# EAGLE design ultravolt_daughterboard (EAGLE 9.0.1)
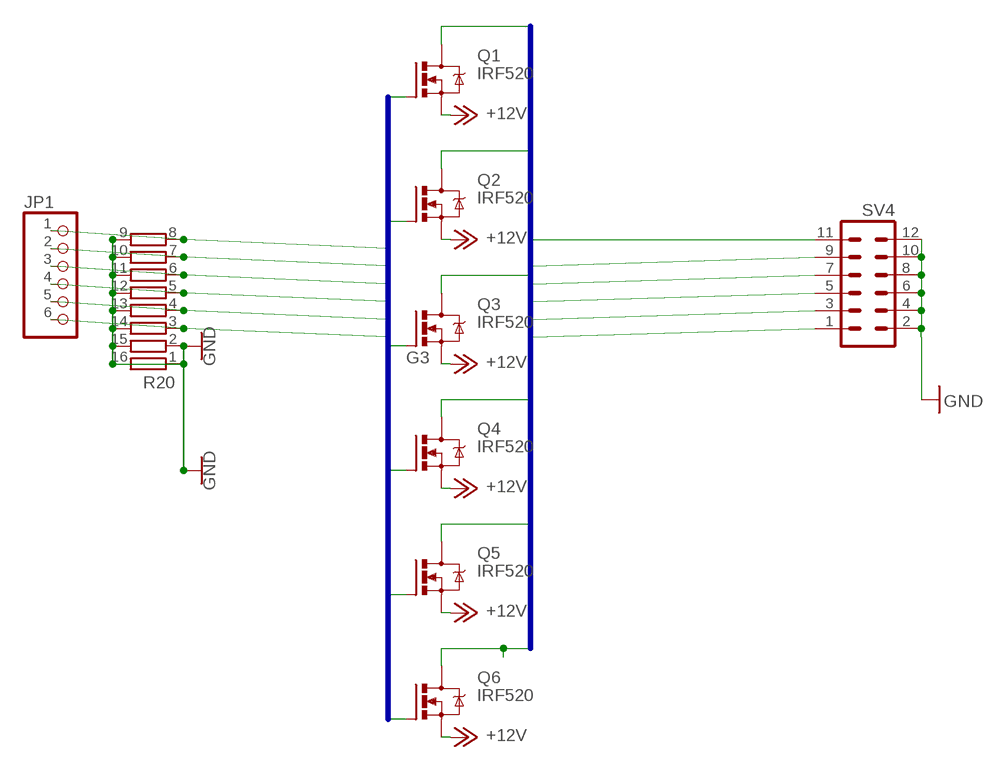
[diagram p0: schematic, sheet 1, part 1 of 2]
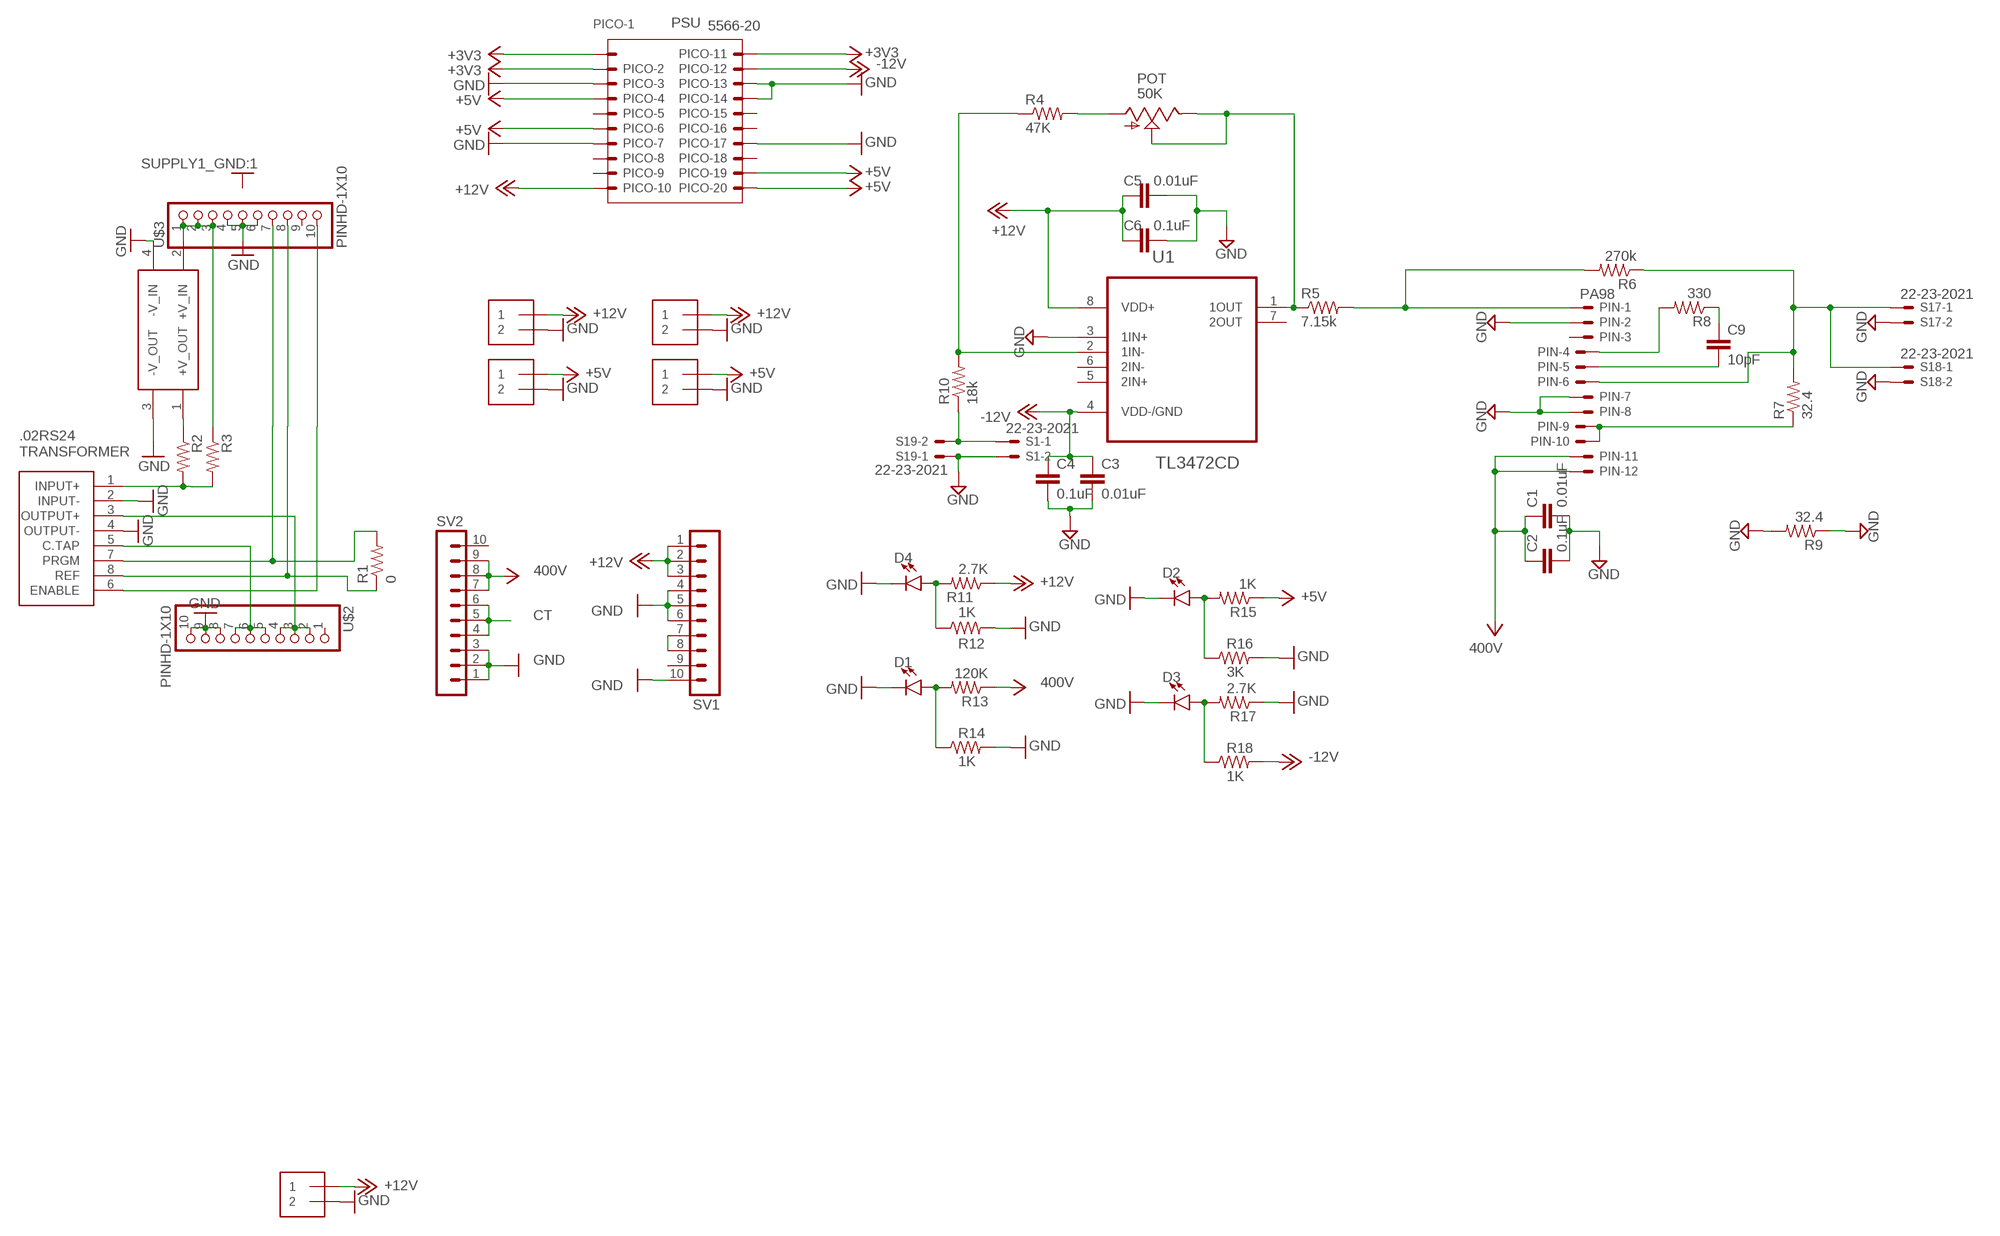
[diagram p1: schematic, sheet 1, part 2 of 2]

## Parts
$ZX1  LUCAS-LIBRARY_12_DC-24_DC  [LUCAS-LIBRARY_12_DC-24_DC]
C1  0.01uF  1.0UF-1206-50V-10%  [1206]
C2  0.1uF  1.0UF-1206-50V-10%  [1206]
C3  0.01uF  1.0UF-1206-50V-10%  [1206]
C4  0.1uF  1.0UF-1206-50V-10%  [1206]
C5  0.01uF  1.0UF-1206-50V-10%  [1206]
C6  0.1uF  1.0UF-1206-50V-10%  [1206]
C9  10pF  1.0UF-1206-50V-10%  [1206]
D1  LED1206  [LED-1206]
D2  LED1206  [LED-1206]
D3  LED1206  [LED-1206]
D4  LED1206  [LED-1206]
J1  1X2-3.5MM  [1X2-3.5MM]
J2  1X2-3.5MM  [1X2-3.5MM]
J4  1X2-3.5MM  [1X2-3.5MM]
J6  1X2-3.5MM  [1X2-3.5MM]
J8  1X2-3.5MM  [1X2-3.5MM]
JP1  PINHD-1X6  [1X06]
PICO  5566-20  [5566-20]
PIN  PA98  22-23-2121  [22-23-2121]
POT  50K  TRIM_US-3223W  [3223W]
Q1  IRF520  [TO220BV]
Q2  IRF520  [TO220BV]
Q3  IRF520  [TO220BV]
Q4  IRF520  [TO220BV]
Q5  IRF520  [TO220BV]
Q6  IRF520  [TO220BV]
R1  0  R-US_M1206  [M1206]
R2  ADAFRUIT_R-US_M0805  [ADAFRUIT_M0805]
R3  ADAFRUIT_R-US_M0805  [ADAFRUIT_M0805]
R4  47K  R-US_M1206  [M1206]
R5  7.15k  R-US_M1206  [M1206]
R6  270k  R-US_M1206  [M1206]
R7  32.4  R-US_M1206  [M1206]
R8  330  R-US_M1206  [M1206]
R9  32.4  R-US_M1206  [M1206]
R10  18k  R-US_M1206  [M1206]
R11  2.7K  R-US_M1206  [M1206]
R12  1K  R-US_M1206  [M1206]
R13  120K  R-US_M1206  [M1206]
R14  1K  R-US_M1206  [M1206]
R15  1K  R-US_M1206  [M1206]
R16  3K  R-US_M1206  [M1206]
R17  2.7K  R-US_M1206  [M1206]
R18  1K  R-US_M1206  [M1206]
R20  4816P-T01  [4816P]
S1  22-23-2021  [22-23-2021]
S17  22-23-2021  [22-23-2021]
S18  22-23-2021  [22-23-2021]
S19  22-23-2021  [22-23-2021]
SV1  MA10-1  [MA10-1]
SV2  MA10-1  [MA10-1]
SV4  MA06-2  [MA06-2]
U1  TL3472CD  [SOIC127P600X175-8N]
U$1  LUCAS-LIBRARY_.2RS24_TRANSFORMER  [LUCAS-LIBRARY_0.2RS24_TRANSFORMER]
U$2  PINHD-1X10  [1X10-BIG]
U$3  PINHD-1X10  [1X10-BIG]

## Nets
+3V3: PICO.1 PICO.2 PICO.11
+5V: J6.1 J8.1 PICO.4 PICO.6 PICO.19 PICO.20 R15.1
+12V: C5.1 C6.1 J1.1 J2.1 J4.1 PICO.10 Q1.S Q2.S Q3.S Q4.S Q5.S Q6.S R11.1 SV1.1 SV1.2 SV1.3 U1.8(VDD+)
-12V: C3.1 C4.1 PICO.12 R18.2 U1.4(VDD-/GND)
CT: SV2.4 SV2.5 SV2.6
D1: Q1.D SV4.11
D2: Q2.D SV4.9
D3: Q3.D SV4.7
D4: Q4.D SV4.5
D5: Q5.D SV4.3
D6: Q6.D SV4.1
G1: JP1.1 Q1.G R20.8
G2: JP1.2 Q2.G R20.7
G3: JP1.3 Q3.G R20.6
G4: JP1.4 Q4.G R20.5
G5: JP1.5 Q5.G R20.4
G6: JP1.6 Q6.G R20.3
GND: $ZX1.3(-V_OUT) $ZX1.4(-V_IN) C1.2 C2.2 C3.2 C4.2 C5.2 C6.2 D1.C D2.C D3.C D4.C J1.2 J2.2 J4.2 J6.2 J8.2 PICO.3 PICO.7 PICO.13 PICO.14 PICO.17 PIN.2 PIN.7 PIN.8 R9.1 R9.2 R12.2 R14.2 R16.2 R17.1 R20.1 R20.9 R20.10 R20.11 R20.12 R20.13 R20.14 R20.15 R20.16 S1.2 S17.2 S18.2 S19.1 SV1.4 SV1.5 SV1.6 SV1.10 SV2.1 SV2.2 SV2.3 SV4.2 SV4.4 SV4.6 SV4.8 SV4.10 SV4.12 U1.3(1IN+) U$1.2(INPUT-) U$1.4(OUTPUT-) U$2.8 U$2.9 U$2.10 U$3.4 U$3.5 U$3.6
N$1: $ZX1.2(+V_IN) R3.1 U$3.1 U$3.2 U$3.3
N$2: $ZX1.1(+V_OUT) R2.1
N$3: R1.2 U$1.7(PRGM) U$3.7
N$4: R1.1 U$1.8(REF) U$3.8
N$5: U$1.6(ENABLE) U$3.10
N$6: U$1.3(OUTPUT+) U$2.2 U$2.3 U$2.4
N$7: U$1.5(C.TAP) U$2.5 U$2.6 U$2.7
N$8: R2.2 R3.2 U$1.1(INPUT+)
N$11: R4.1 R10.2 U1.2(1IN-)
N$12: C9.1 R8.1
N$13: SV1.7 SV1.8
N$26: D4.A R11.2 R12.1
N$27: D1.A R13.2 R14.1
N$28: D2.A R15.2 R16.1
N$29: D3.A R17.2 R18.1
N$30: R20.2
N$46: POT.2(S) POT.3(E) R5.1 U1.1(1OUT)
N$47: PIN.1 R5.2 R6.2
N$48: PIN.9 PIN.10 R7.1
N$49: PIN.4 R8.2
N$51: PIN.6 R6.1 R7.2 S17.1 S18.1
N$52: R10.1 S1.1 S19.2
N$58: POT.1(A) R4.2
N$59: C9.2 PIN.5
V+: C1.1 C2.1 PIN.11 PIN.12 R13.1 SV2.7 SV2.8 SV2.9 ; supply symbol labelled 400V
Unconnected: PICO.5 PICO.8 PICO.9 PICO.15 PICO.16 PICO.18 PIN.3 SV1.9 SV2.10 U1.5(2IN+) U1.6(2IN-) U1.7(2OUT) U$2.1 U$3.9

## Buses
G[1..16]
D[1..10]

## Notes on the sheet
- PSU

## Library data of the parts
$ZX1 = bat-board rev 2.0:LUCAS-LIBRARY_12_DC-24_DC
C1 C3 C5 = SparkFun-Capacitors:1.0UF: 1µF ceramic capacitors A capacitor is a passive two-terminal electrical component used to store electrical energy temporarily in an electric field.; MF: KEMET; MPN: C0805C103K1RACTU; OC_FARNELL: 1414661; PROD_ID: CAP-09822; VALUE: 1.0uF
C2 C4 C6 = SparkFun-Capacitors:1.0UF: 1µF ceramic capacitors A capacitor is a passive two-terminal electrical component used to store electrical energy temporarily in an electric field.; MF: KEMET; MPN: C0805C104J5RACTU; OC_FARNELL: 1414663; PROD_ID: CAP-09822; VALUE: 1.0uF
C9 = SparkFun-Capacitors:1.0UF: 1µF ceramic capacitors A capacitor is a passive two-terminal electrical component used to store electrical energy temporarily in an electric field.; MF: KEMET; MPN: C0805C479C5GACTU; OC_FARNELL: 1800809; PROD_ID: CAP-09822; VALUE: 1.0uF
D1-D4 = SparkFun-LED:LED: LED (Generic) Standard schematic elements and footprints for 5mm, 3mm, 1206, and 0603 sized LEDs. Generic LEDs with no color specified.
J1 J2 J4 J6 J8 = adafruit:1X2: 3.5mm Terminal block http://www.ladyada.net/library/pcb/eaglelibrary.html
JP1 = pinhead:PINHD-1X6: PIN HEADER
PICO = con-molex:5566-20: Mini FIT connector 20 pol ATX PC-Motherboard Power connector Source: http://www.molex.com; OC_FARNELL: unknown; OC_NEWARK: unknown
PIN = con-molex:22-23-2121: .100" (2.54mm) Center Header - 12 Pin; OC_FARNELL: unknown; OC_NEWARK: 56H0456
POT = pot:TRIM_US-: POTENTIOMETER
Q1-Q6 = transistor-power:IRF520: HEXFET Power MOSFET
R1 = resistor:R-US_: RESISTOR, American symbol; SPICEPREFIX: R
R2 R3 = bat-board rev 2.0:ADAFRUIT_R-US_: RESISTOR, American symbol
R4 = adafruit:R-US_: RESISTOR, American symbol; MF: KOA SPEAR ELECTRONICS; MPN: SG73S2ATTD9102F; OC_FARNELL: 1400374
R5 = adafruit:R-US_: RESISTOR, American symbol; MF: VISHAY; MPN: CRCW08057K15FKEA; OC_FARNELL: 1152455
R6 = adafruit:R-US_: RESISTOR, American symbol; MF: WELWYN; MPN: WCR0805-270KFI; OC_FARNELL: 1100330RL
R7-R9 = adafruit:R-US_: RESISTOR, American symbol; MF: PANASONIC ELECTRONIC COMPONENTS; MPN: ERJ8ENF32R4V; OC_FARNELL: 2307627
R10-R18 = adafruit:R-US_: RESISTOR, American symbol; MF: WELWYN; MPN: WCR0805-18KFI; OC_FARNELL: 1100322
R20 = resistor-bourns:4816P-T01: BOURNS RESISTOR NETWORK; MF: BOURNS, INC.; MPN: 4816P-T01-684LF; OC_FARNELL: 9357483; OC_NEWARK: 33K0707
S1 S17-S19 = con-molex:22-23-2021: .100" (2.54mm) Center Header - 2 Pin; MF: MOLEX; MPN: 22-23-2021; OC_FARNELL: 1462926; OC_NEWARK: 25C3832
SV1 SV2 = con-lstb:MA10-1: PIN HEADER; OC_FARNELL: unknown; OC_NEWARK: unknown
SV4 = con-lstb:MA06-2: PIN HEADER; OC_FARNELL: unknown; OC_NEWARK: unknown
U1 = TL3472CD:TL3472CD: HIGH-SLEW-RATE, SINGLE-SUPPLY OPERATIONAL AMPLIFIER; AVAILABILITY: Good; DESCRIPTION: High-Slew- ate, Single-Supply Operational Amplifier 8-SOIC 0 to 70; MF: Texas Instruments; MP: TL3472CD; OC_FARNELL: unknown; PACKAGE: SOIC-8 Texas Instruments; PRICE: 0.47 USD
U$1 = bat-board rev 2.0:LUCAS-LIBRARY_.2RS24_TRANSFORMER
U$2 U$3 = adafruit:PINHD-1X10: Pin header 1x10 0.1" spacing With round pins

## Board
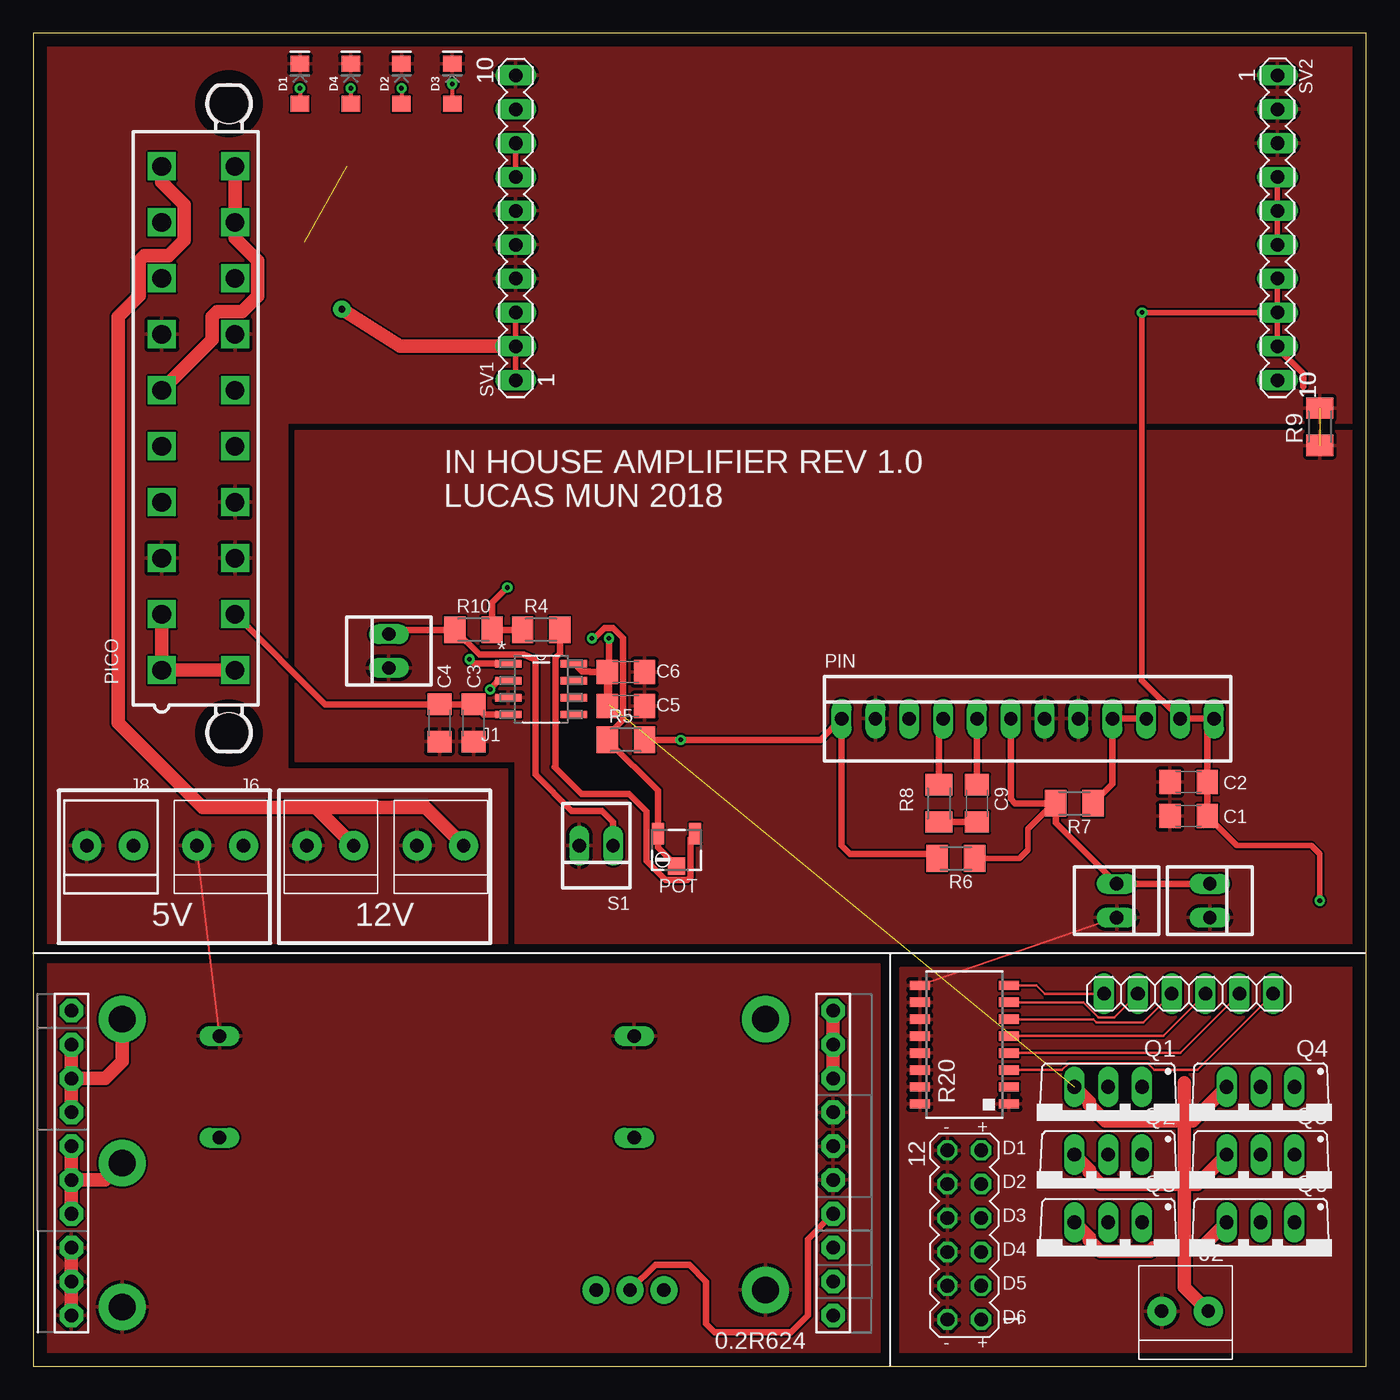
[diagram p2: board, top side]
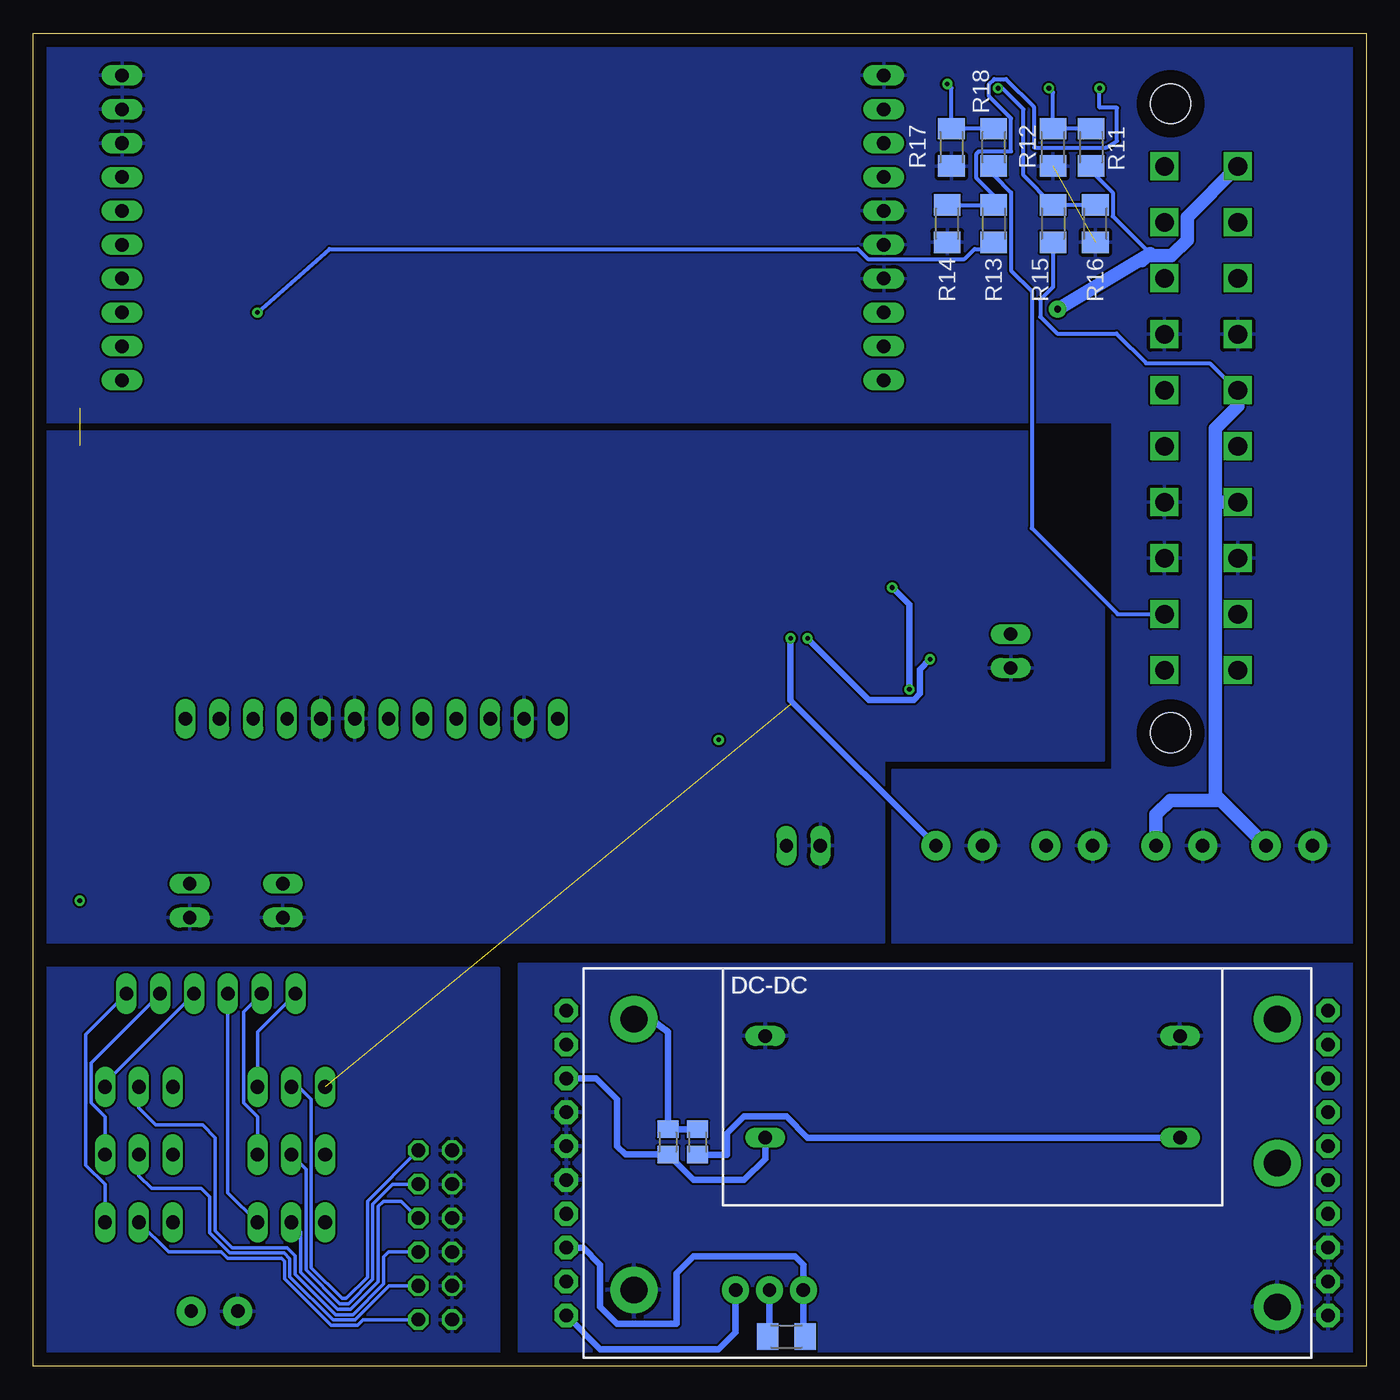
[diagram p3: board, bottom side, seen from below]

Size 100 x 100 mm. Coordinates in mm from the lower left corner, seen from the top.
Outline: 0,0 100,0 100,100 0,100 0,0
Copper layers (1*16): Top 0.035mm / dielectric 1.5mm / Bottom 0.035mm
Design rules "default": minimum track width 6mil, minimum drill 0.35mm, track to track 6mil, track to pad 6mil, pad to pad 6mil, via to via 6mil, smd to smd 6mil, copper to edge 40mil, drill to drill 6mil, minimum pad ring 10mil, minimum via ring 8mil, stop-mask expansion 4mil, vias tented up to drill 0mil, thermal gap 10mil

### Footprints (pad centres in the part's own frame; a part is rotated, then mirrored left to right if it is on the bottom)
LUCAS-LIBRARY_12_DC-24_DC = drill 1 long: 1 -15.875,3.81; 2 15.24,3.81; 3 -15.875,-3.81; 4 15.24,-3.81
1206 = smd 1.6 x 1.8: 1 -1.4,0; 2 1.4,0
LED-1206 = smd 1.2 x 1.4: A -1.5,0; C 1.5,0
1X2-3.5MM = drill 1 pad 2.184: 1 1.8,0; 2 -1.7,0
1X06 = drill 1.016 long: 1 -6.35,0; 2 -3.81,0; 3 -1.27,0; 4 1.27,0; 5 3.81,0; 6 6.35,0
5566-20 = drill 1.4 square: 1 18.9,-2.75; 2 14.7,-2.75; 3 10.5,-2.75; 4 6.3,-2.75; 5 2.1,-2.75; 6 -2.1,-2.75; 7 -6.3,-2.75; 8 -10.5,-2.75; 9 -14.7,-2.75; 10 -18.9,-2.75; 11 18.9,2.75; 12 14.7,2.75; 13 10.5,2.75; 14 6.3,2.75; 15 2.1,2.75; 16 -2.1,2.75; 17 -6.3,2.75; 18 -10.5,2.75; 19 -14.7,2.75; 20 -18.9,2.75 | hole 3: 23.6,2.29; -23.6,2.29
22-23-2121 = drill 1 long: 1 -13.97,0; 2 -11.43,0; 3 -8.89,0; 4 -6.35,0; 5 -3.81,0; 6 -1.27,0; 7 1.27,0; 8 3.81,0; 9 6.35,0; 10 8.89,0; 11 11.43,0; 12 13.97,0
3223W = smd 0.9 x 1.6: 1 -1.4,-1.215; 3 1.4,-1.215 | smd 1.3 x 1.3: 2 0,1.215
TO220BV = drill 1.016 long: D 0,-2.54; G -2.54,-2.54; S 2.54,-2.54
M1206 = smd 1.6 x 2: 1 -1.4,0; 2 1.4,0
ADAFRUIT_M0805 = smd 1.3 x 1.6: 1 -0.95,0; 2 0.95,0
4816P = smd 0.7 x 1.5: 1 -4.445,-3.346; 2 -3.175,-3.346; 3 -1.905,-3.346; 4 -0.635,-3.346; 5 0.635,-3.346; 6 1.905,-3.346; 7 3.175,-3.346; 8 4.445,-3.346; 9 4.445,3.346; 10 3.175,3.346; 11 1.905,3.346; 12 0.635,3.346; 13 -0.635,3.346; 14 -1.905,3.346; 15 -3.175,3.346; 16 -4.445,3.346
22-23-2021 = drill 1 long: 1 -1.27,0; 2 1.27,0
MA10-1 = drill 1.016 long: 1 -11.43,0; 2 -8.89,0; 3 -6.35,0; 4 -3.81,0; 5 -1.27,0; 6 1.27,0; 7 3.81,0; 8 6.35,0; 9 8.89,0; 10 11.43,0
MA06-2 = drill 1.016 octagon: 1 -6.35,-1.27; 2 -6.35,1.27; 3 -3.81,-1.27; 4 -3.81,1.27; 5 -1.27,-1.27; 6 -1.27,1.27; 7 1.27,-1.27; 8 1.27,1.27; 9 3.81,-1.27; 10 3.81,1.27; 11 6.35,-1.27; 12 6.35,1.27
SOIC127P600X175-8N = smd 1.981 x 0.559: 1 -2.464,1.905; 2 -2.464,0.635; 3 -2.464,-0.635; 4 -2.464,-1.905; 5 2.464,-1.905; 6 2.464,-0.635; 7 2.464,0.635; 8 2.464,1.905
LUCAS-LIBRARY_0.2RS24_TRANSFORMER = drill 2 pad 3.5: 1 25.4,12.065; 2 25.4,-8.255; 3 -22.86,12.065; 4 -22.86,-9.525; 5 -22.86,1.27 | drill 1 pad 2.032: 6 17.78,-8.255; 7 15.24,-8.255; 8 12.7,-8.255
1X10-BIG = drill 1.016 pad 1.778 octagon: 1 -11.43,0; 2 -8.89,0; 3 -6.35,0; 4 -3.81,0; 5 -1.27,0; 6 1.27,0; 7 3.81,0; 8 6.35,0; 9 8.89,0; 10 11.43,0

### Placement (x,y rotation side)
$ZX1  29.84,20.95 180 bottom
C1  86.68,41.27 180 top
C2  86.68,43.81 180 top
C3  33.02,48.26 270 top
C4  30.48,48.26 270 top
C5  44.45,49.53 0 top
C6  44.45,52.07 0 top
C9  70.8,42.23 90 top
D1  20,96.2 90 top
D2  27.62,96.2 90 top
D3  31.43,96.2 90 top
D4  23.81,96.2 90 top
J1  30.48,39.05 0 top
J2  86.36,4.13 0 top
J4  22.23,39.05 0 top
J6  13.97,39.05 0 top
J8  5.71,39.05 0 top
JP1  86.68,27.94 0 top
PICO  12.38,71.12 270 top
PIN  74.61,48.58 0 top
POT  48.26,38.73 180 top
Q1  80.64,18.41 180 top
Q2  80.64,13.34 180 top
Q3  80.64,8.26 180 top
Q4  92.08,18.41 180 top
Q5  92.08,13.34 180 top
Q6  92.08,8.26 180 top
R1  43.5,2.22 180 bottom
R2  50.16,16.83 90 bottom
R3  52.39,16.83 90 bottom
R4  38.1,55.24 0 top
R5  44.45,46.99 0 top
R6  69.22,38.1 180 top
R7  78.11,42.23 180 top
R8  67.94,42.23 90 top
R9  96.52,70.48 90 top
R10  33.02,55.24 0 top
R11  20.64,91.44 90 bottom
R12  23.5,91.44 270 bottom
R13  27.94,85.72 90 bottom
R14  31.43,85.72 270 bottom
R15  23.5,85.72 90 bottom
R16  20.32,85.72 270 bottom
R17  31.11,91.44 90 bottom
R18  27.94,91.44 270 bottom
R20  69.85,24.13 90 top
S1  42.23,39.05 180 top
S17  81.28,34.92 270 top
S18  88.27,34.92 270 top
S19  26.67,53.66 90 top
SV1  36.2,85.41 90 top
SV2  93.34,85.41 270 top
SV4  69.85,9.84 90 top
U1  38.1,50.8 0 top
U$1  29.53,13.97 0 top
U$2  2.86,15.24 270 top
U$3  60.01,15.24 270 top

### Tracks (layer width: path | path; a pad name or v marks a point on that pad's centre or on a via)
+3V3
  Top 1: PICO.2 PICO.1 PICO.11
+5V
  Top 1: PICO.20 PICO.19 15.13,84.64 16.84,82.94 16.84,80.3 15.66,79.12 13.81,79.12 13.43,78.74 13.43,77.02 PICO.6
  Bottom 0.3: R15.1 23.5,80.96 24.45,80.01 24.45,78.74 23.18,77.47 18.73,77.47 16.51,75.25 11.75,75.25 9.72,73.22 PICO.6
  Bottom 1: PICO.6 9.63,72.04 11.34,70.34 11.34,64.77 | 11.34,64.77 11.34,42.87 10.9,42.44 | 10.9,42.44 J8.1 | 10.9,42.44 14.71,42.44 15.77,41.38 J6.1 | PICO.4 11.29,64.82 11.34,64.77
+12V  (via drill 0.35, 0.5 pad 1.3)  (1 unrouted)
  Top 0.4: SV1.3 SV1.2 SV1.1
  Top 0.5: U1.8 41.15,52.12 41.72,52.12 41.77,52.07 43.18,52.07 | 43.18,52.07 43.18,49.66 | 43.18,49.66 C5.1 | v43.18,54.61 43.18,52.07 | C6.1 43.05,49.79 43.18,49.66
  Top 1: PICO.10 9.63,88.84 11.34,87.14 11.34,84.5 10.16,83.32 8.31,83.32 7.93,82.94 7.93,80.32 6.35,78.74 6.35,48.26 12.7,41.91 21.17,41.91 | 21.17,41.91 J4.1 | 21.17,41.91 29.42,41.91 J1.1 | v23.15,79.31 27.52,76.52 SV1.2 | J2.1 86.36,5.93 86.36,8.89 | 86.36,8.89 86.36,13.65 | 86.36,13.65 86.36,18.41 | 86.36,18.41 86.36,21.27 | Q1.S 79.23,19.83 79.23,19.61 80.42,18.41 86.36,18.41 | 86.36,18.41 87,18.41 Q4.S | Q2.S 79.23,14.75 79.23,14.53 80.11,13.65 86.36,13.65 | 86.36,13.65 87.31,13.65 Q5.S | 86.36,8.89 84.04,8.89 83.77,8.62 80.06,8.62 79.23,9.45 79.23,9.67 Q3.S | 86.36,8.89 87.63,8.89 Q6.S
  Bottom 0.3: 16.2,83.45 19.02,86.27 19.02,88.05 20.64,89.67 R11.1
  Bottom 0.5: J1.1 43.18,49.95 v43.18,54.61
  Bottom 1: PICO.10 13.43,86.22 13.43,84.5 14.61,83.32 16.45,83.32 16.84,82.94 16.2,83.45 v23.15,79.31
-12V
  Top 0.5: PICO.12 21.89,49.66 C4.1 C3.1 33.78,48.9 U1.4
  Bottom 0.3: R18.2 27.94,89.35 26.64,88.05 26.64,82.2 25.08,80.64 25.08,62.87 18.64,56.42 PICO.12
CT
  Top 0.4: SV2.4 SV2.5 SV2.6
D1
  Bottom 0.25: SV4.11 74.93,12.38 74.93,6.67 76.52,5.08 76.83,5.08 79.14,7.39 79.14,20 80.1,20.95 Q1.D
D2
  Bottom 0.25: SV4.9 73.03,13.65 74.53,12.15 74.53,6.5 76.35,4.68 77,4.68 79.55,7.22 79.55,14.78 Q2.D
D3
  Bottom 0.25: SV4.7 72.39,12.38 73.73,12.38 74.12,11.98 74.12,6.33 76.18,4.28 77.17,4.28 79.95,7.06 79.95,10.1 Q3.D
D4
  Bottom 0.25: SV4.5 73.34,8.57 73.72,8.19 73.72,6.17 76.02,3.87 77.33,3.87 80.35,6.89 80.35,8.28 80.96,8.89 85.09,8.89 86.36,10.16 86.36,17.14 87.31,18.1 90.81,18.1 92.08,19.37 Q4.D
D5
  Bottom 0.25: SV4.3 73.29,6.03 75.85,3.47 77.5,3.47 80.75,6.72 80.75,8.05 81.19,8.49 85.26,8.49 86.76,9.99 86.76,12.7 87.4,13.34 91.12,13.34 92.08,14.29 Q5.D
D6
  Bottom 0.25: SV4.1 75.26,3.49 75.68,3.07 77.67,3.07 81.16,6.56 81.16,7.88 81.36,8.09 85.42,8.09 85.91,8.57 89.85,8.57 Q6.D
G1
  Top 0.2: JP1.1 75.88,27.94 75.25,28.57 R20.8
  Bottom 0.25: JP1.1 83.19,25.08 Q1.G
G2
  Top 0.2: R20.7 78.77,27.3 79.91,26.16 81.09,26.16 JP1.2
  Bottom 0.25: Q2.G 83.19,18.72 84.22,19.76 84.22,26.58 JP1.2
G3
  Top 0.2: R20.6 79.54,26.04 79.76,25.81 83.28,25.81 JP1.3
  Bottom 0.25: JP1.3 85.41,13.02 Q3.G
G4
  Top 0.2: JP1.4 84.77,24.77 R20.5
  Bottom 0.25: JP1.4 94.61,21.27 Q4.G
G5
  Top 0.2: JP1.5 86.04,23.5 R20.4
  Bottom 0.25: Q5.G 94.61,18.72 95.65,19.76 95.65,22.77 JP1.5
G6
  Top 0.2: JP1.6 87.31,22.23 84.11,22.23 83.61,22.73 77.69,22.73 77.18,22.23 R20.3
  Bottom 0.25: Q6.G 94.61,13.64 96.06,15.09 96.06,24.91 JP1.6
GND  (2 unrouted)
  Top 0.152: $ZX1.3 J6.2 | S17.2 R20.9
  Top 1: U$2.8 U$2.9 U$2.10
  pour Bottom: 0,0 63.5,0 63.5,30.16 0,30.16
  pour Top: 0,0 63.5,0 63.5,30.16 0,30.16
  pour Top: 0,100.01 0,31.75 35.56,31.75 35.56,44.77 19.05,44.77 19.05,70.8 100.01,70.8 100.01,100.01
  pour Top: 100.01,70.17 19.68,70.17 19.68,45.4 36.2,45.4 36.2,31.75 100.01,31.75
  pour Bottom: 19.68,70.17 19.68,45.4 36.2,45.4 36.2,31.75 100.01,31.75 100.01,70.17
  pour Bottom: 0,100.01 0,31.75 35.56,31.75 35.56,44.77 19.05,44.77 19.05,70.8 100.01,70.8 100.01,100.01
  pour Bottom: 65.09,0.64 65.09,0.32 99.69,0.32 99.69,29.84 65.09,29.84
  pour Top: 65.09,0.32 99.69,0.32 99.69,29.84 65.09,29.84
N$1
  Top 1: U$3.1 U$3.2 U$3.3
  Bottom 0.5: U$3.3 57.78,21.59 56.2,20 56.2,16.51 55.56,15.88 R3.1 51.75,15.24 50.48,13.97 46.67,13.97 45.09,15.56 $ZX1.2
N$2
  Bottom 0.5: $ZX1.1 41.91,17.14 43.5,18.73 46.67,18.73 47.94,17.46 47.94,15.88 49.53,15.88 R2.1
N$3
  Top 0.5: U$1.7 46.67,7.62 47.31,7.62 49.21,7.62 50.48,6.35 50.48,3.17 51.12,2.54 56.83,2.54 58.1,3.81 58.1,9.53 U$3.7
  Bottom 0.5: U$1.7 44.77,2.54 R1.2
N$4
  Bottom 0.5: U$3.8 58.74,8.89 57.47,7.62 57.47,4.45 56.2,3.17 51.75,3.17 51.75,6.99 50.48,8.26 42.86,8.26 42.23,7.62 U$1.8 42.23,2.54 R1.1
N$5
  Bottom 0.5: U$1.6 47.31,2.54 48.58,1.27 57.47,1.27 U$3.10
N$6
  Top 1: U$2.2 U$2.3 | U$2.3 U$2.4 | U$2.3 5.4,21.59 6.67,22.86 U$1.3
N$7
  Top 1: U$2.5 U$2.6 | U$2.6 U$2.7 | U$2.6 5.4,13.97 U$1.5
N$8
  Bottom 0.5: R2.2 R3.2 52.39,25.09 53.66,26.04 54.61,26.04 U$1.1
N$11  (via drill 0.35)
  Top 0.5: R4.1 R10.2 34.42,57.28 v35.56,58.42 | U1.2 34.89,51.44 v34.27,50.78
  Bottom 0.5: v34.27,50.78 34.27,57.13 v35.56,58.42
N$12
  Top 0.5: R8.1 C9.1
N$13
  Top 0.4: SV1.8 SV1.7
N$26  (via drill 0.35)
  Top 0.3: v23.81,95.89 D4.A
  Bottom 0.3: R11.2 R12.1 23.5,95.57 v23.81,95.89
N$27  (via drill 0.35)
  Top 0.3: v20,95.89 D1.A
  Bottom 0.3: R14.1 R13.2 27.94,87.81 29.24,89.11 29.24,90.97 29.07,91.14 26.64,91.14 26.64,93.62 28.3,95.29 28.3,96.17 27.9,96.57 27.02,96.57 24.95,94.49 24.95,91.79 24.9,91.42 19.51,91.42 18.7,91.92 18.7,94.4 20,94.43 v20,95.89
N$28  (via drill 0.35)
  Top 0.3: v27.62,95.89 D2.A
  Bottom 0.3: R16.1 R15.2 25.72,89.35 25.72,94.3 27.3,95.89 v27.62,95.89
N$29  (via drill 0.35)
  Top 0.3: v31.43,96.2 D3.A
  Bottom 0.3: R18.1 R17.2 31.11,95.89 v31.43,96.2
N$46  (via drill 0.35)
  Top 0.5: R5.1 43.12,46.92 | 43.12,46.92 46.86,43.18 POT.3 46.86,38.92 POT.2 | U1.1 33.06,52.7 v32.72,53.04 | 43.12,46.92 43.12,47.33 44.25,48.46 44.25,54.64 43.5,55.39 42.86,55.39 42.08,54.61 v41.91,54.61
  Bottom 0.5: v32.72,53.04 33.49,52.27 33.49,50.46 33.95,50 37.3,50 v41.91,54.61
N$47  (via drill 0.35)
  Top 0.5: R5.2 v48.58,46.99 59.05,46.99 PIN.1 60.64,39.05 61.28,38.42 67.5,38.42 R6.2
N$48
  Top 0.5: PIN.10 PIN.9 80.96,43.69 R7.1
N$49
  Top 0.5: R8.2 67.94,48.26 PIN.4
N$51
  Top 0.4: R6.1 73.98,38.1 74.61,38.73 74.61,40.29 76.55,42.23 R7.2
  Top 0.5: R7.2 76.7,40.77 S17.1 S18.1 | PIN.6 73.34,42.55 73.66,42.23 76.55,42.23
N$52
  Top 0.5: S19.2 26.99,55.24 R10.1 33.48,53.39 36.79,53.39 37.66,53.02 37.66,44.38 40.39,41.66 42.67,41.66 43.5,40.83 S1.1
N$58
  Top 0.5: R4.2 39.5,53.48 39.17,53.15 39.17,45.01 39.12,44.96 41.15,42.93 44.69,42.93 46.01,41.61 46.01,37.9 47.44,36.47 49.08,36.47 49.31,36.7 49.31,39.6 POT.1
N$59
  Top 0.5: PIN.5 C9.2
V+  (via drill 0.35)
  Top 0.4: SV2.7 SV2.8 | SV2.8 SV2.9 | SV2.8 88.27,79.06 v83.19,79.06 83.19,51.44 | C1.1 90.3,39.05 95.89,39.05 96.52,38.42 v96.52,34.92
  Top 0.5: 83.19,51.44 PIN.11 PIN.12 88.08,48.07 C2.1 C1.1 | 95.27,73.5 95.27,74.46 93.34,76.39 SV2.9
  Bottom 0.3: v83.19,79.06 77.79,83.82 38.15,83.82 37.4,83.07 30.14,83.07 29.39,83.82 27.94,83.82 R13.1

### Text on the board
tDocu: N.C. | +IN | +OUT | -IN | CT | 10V | PRGM | N.C | -OUT | EN
bDocu: Step-Up | Direct Supply | MAX-OUT
tSilk: IN HOUSE AMPLIFIER REV 1.0 | LUCAS MUN 2018 | 5V | 12V | - | + | D1 | D2 | D3 | D4 | D5 | D6 | - | +
_tplace: 10 | 10 | 10 | 10 | 10 | 10 | 1 | 1 | 1
_bplace: DC-DC | DC-DC | DC-DC